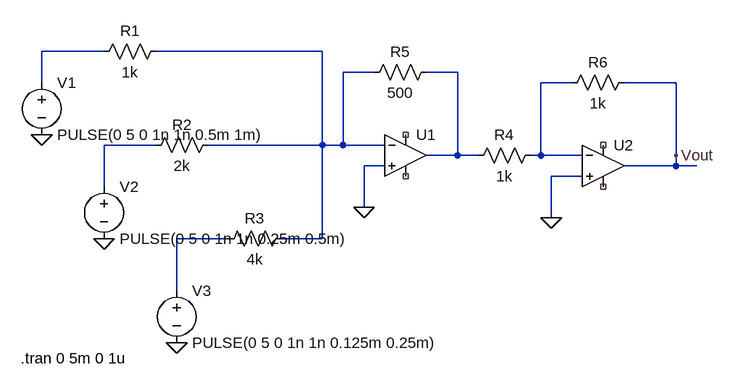
[diagram p0: schematic 2ei4_project5.asc]
2ei4_project5.asc, the LTspice schematic file:
Version 4.1
SHEET 1 1004 680
WIRE 80 64 -16 64
WIRE 416 64 160 64
WIRE 496 96 448 96
WIRE 624 96 576 96
WIRE -16 112 -16 64
WIRE 800 112 752 112
WIRE 960 112 880 112
WIRE 160 208 80 208
WIRE 416 208 416 64
WIRE 416 208 240 208
WIRE 448 208 448 96
WIRE 448 208 416 208
WIRE 512 208 448 208
WIRE 624 224 624 96
WIRE 624 224 576 224
WIRE 656 224 624 224
WIRE 752 224 752 112
WIRE 752 224 736 224
WIRE 816 224 752 224
WIRE 960 224 960 112
WIRE 512 240 480 240
WIRE 960 240 960 224
WIRE 960 240 880 240
WIRE 992 240 960 240
WIRE 816 256 768 256
WIRE 80 272 80 208
WIRE 480 304 480 240
WIRE 768 320 768 256
WIRE 272 352 192 352
WIRE 416 352 416 208
WIRE 416 352 352 352
WIRE 192 432 192 352
FLAG -16 192 0
FLAG 80 352 0
FLAG 192 512 0
FLAG 480 304 0
FLAG 768 320 0
FLAG 960 224 Vout
SYMBOL voltage -16 96 R0
WINDOW 123 0 0 Left 0
WINDOW 39 0 0 Left 0
SYMATTR InstName V1
SYMATTR Value PULSE(0 5 0 1n 1n 0.5m 1m)
SYMBOL voltage 80 256 R0
WINDOW 123 0 0 Left 0
WINDOW 39 0 0 Left 0
SYMATTR InstName V2
SYMATTR Value PULSE(0 5 0 1n 1n 0.25m 0.5m)
SYMBOL voltage 192 416 R0
WINDOW 123 0 0 Left 0
WINDOW 39 0 0 Left 0
SYMATTR InstName V3
SYMATTR Value PULSE(0 5 0 1n 1n 0.125m 0.25m)
SYMBOL res 176 48 R90
WINDOW 0 0 56 VBottom 2
WINDOW 3 32 56 VTop 2
SYMATTR InstName R1
SYMATTR Value 1k
SYMBOL res 256 192 R90
WINDOW 0 0 56 VBottom 2
WINDOW 3 32 56 VTop 2
SYMATTR InstName R2
SYMATTR Value 2k
SYMBOL res 368 336 R90
WINDOW 0 0 56 VBottom 2
WINDOW 3 32 56 VTop 2
SYMATTR InstName R3
SYMATTR Value 4k
SYMBOL OpAmps\\UniversalOpAmp1 544 224 R0
SYMATTR InstName U1
SYMBOL OpAmps\\UniversalOpAmp1 848 240 R0
SYMATTR InstName U2
SYMBOL res 752 208 R90
WINDOW 0 0 56 VBottom 2
WINDOW 3 32 56 VTop 2
SYMATTR InstName R4
SYMATTR Value 1k
SYMBOL res 592 80 R90
WINDOW 0 0 56 VBottom 2
WINDOW 3 32 56 VTop 2
SYMATTR InstName R5
SYMATTR Value 500
SYMBOL res 896 96 R90
WINDOW 0 0 56 VBottom 2
WINDOW 3 32 56 VTop 2
SYMATTR InstName R6
SYMATTR Value 1k
TEXT -48 536 Left 2 !.tran 0 5m 0 1u

The netlist it stands for:
* 2ei4_project5.asc
V1 N001 0 PULSE(0 5 0 1n 1n 0.5m 1m)
V2 N005 0 PULSE(0 5 0 1n 1n 0.25m 0.5m)
V3 N006 0 PULSE(0 5 0 1n 1n 0.125m 0.25m)
R1 N002 N001 1k
R2 N002 N005 2k
R3 N002 N006 4k
X§U1 0 N002 NC_01 NC_02 N003 level1 Avol=1Meg GBW=10Meg Vos=0 En=0 Enk=0 In=0 Ink=0 Rin=500Meg  ; pins In+ In- V+ V- OUT
X§U2 0 N004 NC_03 NC_04 Vout level1 Avol=1Meg GBW=10Meg Vos=0 En=0 Enk=0 In=0 Ink=0 Rin=500Meg  ; pins In+ In- V+ V- OUT
R4 N004 N003 1k
R5 N003 N002 500
R6 Vout N004 1k
.tran 0 5m 0 1u
.lib UniversalOpAmp1.lib
.backanno
.end